# Altium project CSI_Inverter_400Hz_V1.2.PrjPcb
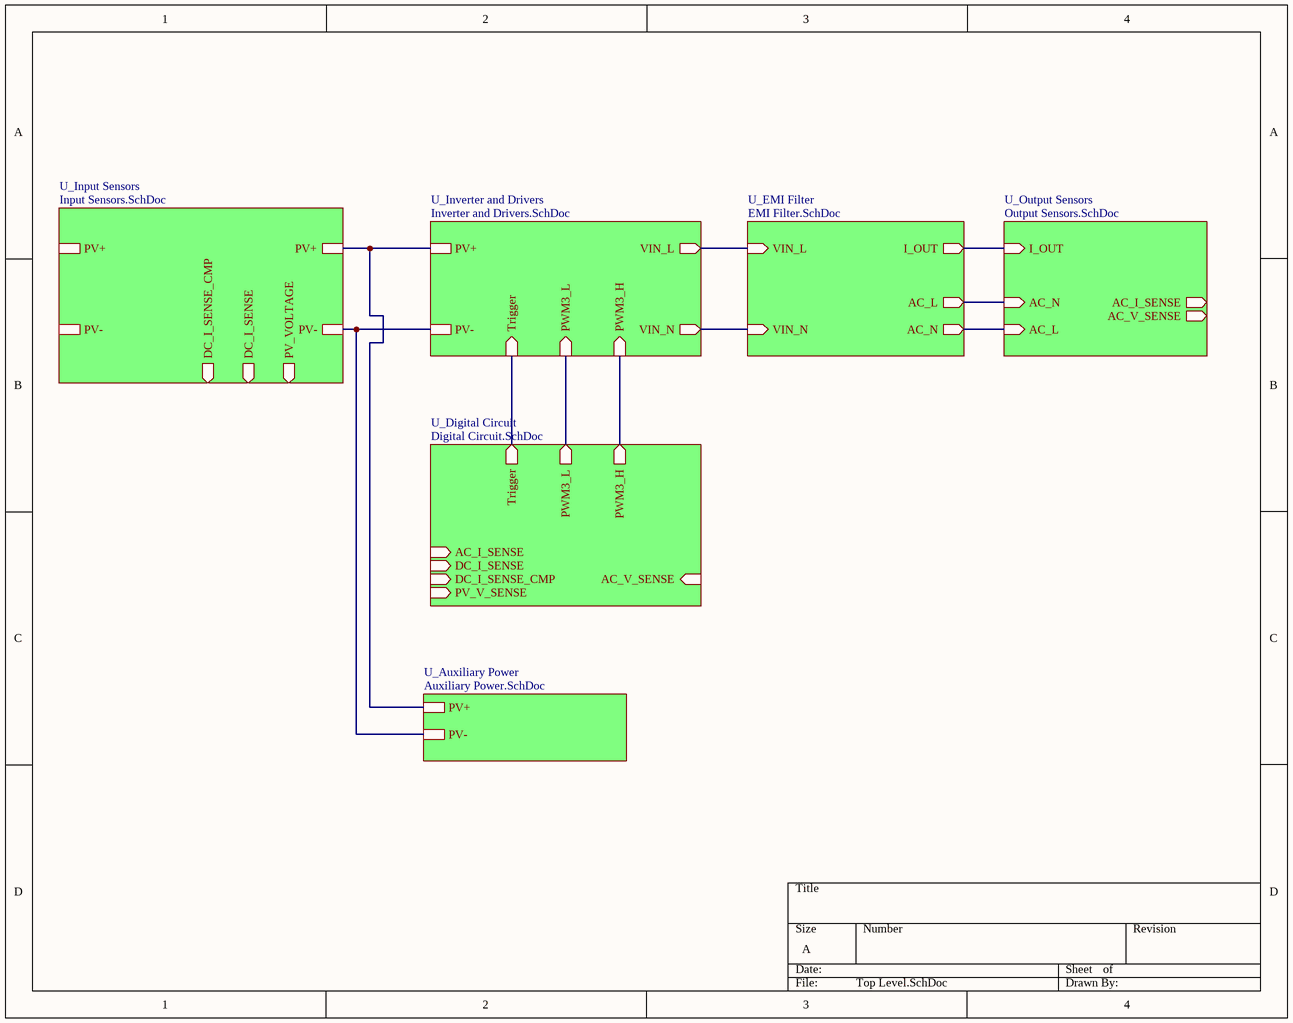
[diagram p0: Top Level.SchDoc]
7 sheets, 167 parts. Net scope: hierarchical (ports join the sheet entries above them; power ports are global).
Board file: PCB1.PcbDoc
Sheets:
  Top Level.SchDoc
    U_Inverter and Drivers = Inverter and Drivers.SchDoc
    U_Input Sensors = Input Sensors.SchDoc
    U_Output Sensors = Output Sensors.SchDoc
    U_EMI Filter = EMI Filter.SchDoc
    U_Digital Circuit = Digital Circuit.SchDoc
    U_Auxiliary Power = Auxiliary Power.SchDoc

## Sheet Top Level.SchDoc
size A

### Sub-sheets
U_Auxiliary Power = Auxiliary Power.SchDoc: PV-, PV+
U_Digital Circuit = Digital Circuit.SchDoc: PWM3_L (out), PWM3_H (out), Trigger (out), AC_I_SENSE (in), DC_I_SENSE (in), DC_I_SENSE_CMP (in), PV_V_SENSE (in), AC_V_SENSE (in)
U_EMI Filter = EMI Filter.SchDoc: VIN_L (in), VIN_N (in), I_OUT (out), AC_L (out), AC_N (out)
U_Input Sensors = Input Sensors.SchDoc: PV_VOLTAGE (out), PV-, DC_I_SENSE (out), DC_I_SENSE_CMP (out), PV+, PV+, PV-
U_Inverter and Drivers = Inverter and Drivers.SchDoc: VIN_L (out), VIN_N (out), Trigger (in), PWM3_L (in), PWM3_H (in), PV+, PV-
U_Output Sensors = Output Sensors.SchDoc: I_OUT (in), AC_N (in), AC_L (in), AC_I_SENSE (out), AC_V_SENSE (out)

### Nets
TH3_1: sheet U_Inverter and Drivers/PV-, sheet U_Input Sensors/PV-, sheet U_Input Sensors/PV-, sheet U_Auxiliary Power/PV-
AC_L: sheet U_Output Sensors/AC_L, sheet U_EMI Filter/AC_N
AC_N: sheet U_Output Sensors/AC_N, sheet U_EMI Filter/AC_L
I_OUT: sheet U_Output Sensors/I_OUT, sheet U_EMI Filter/I_OUT
PV+: sheet U_Inverter and Drivers/PV+, sheet U_Input Sensors/PV+, sheet U_Input Sensors/PV+, sheet U_Auxiliary Power/PV+
PWM3H: sheet U_Inverter and Drivers/PWM3_H, sheet U_Digital Circuit/PWM3_H
PWM3L: sheet U_Inverter and Drivers/PWM3_L, sheet U_Digital Circuit/PWM3_L
TH1_1: sheet U_Inverter and Drivers/VIN_L, sheet U_EMI Filter/VIN_L
TH2_1: sheet U_Inverter and Drivers/VIN_N, sheet U_EMI Filter/VIN_N
Trigger: sheet U_Inverter and Drivers/Trigger, sheet U_Digital Circuit/Trigger

## Sheet Inverter and Drivers.SchDoc
size A3
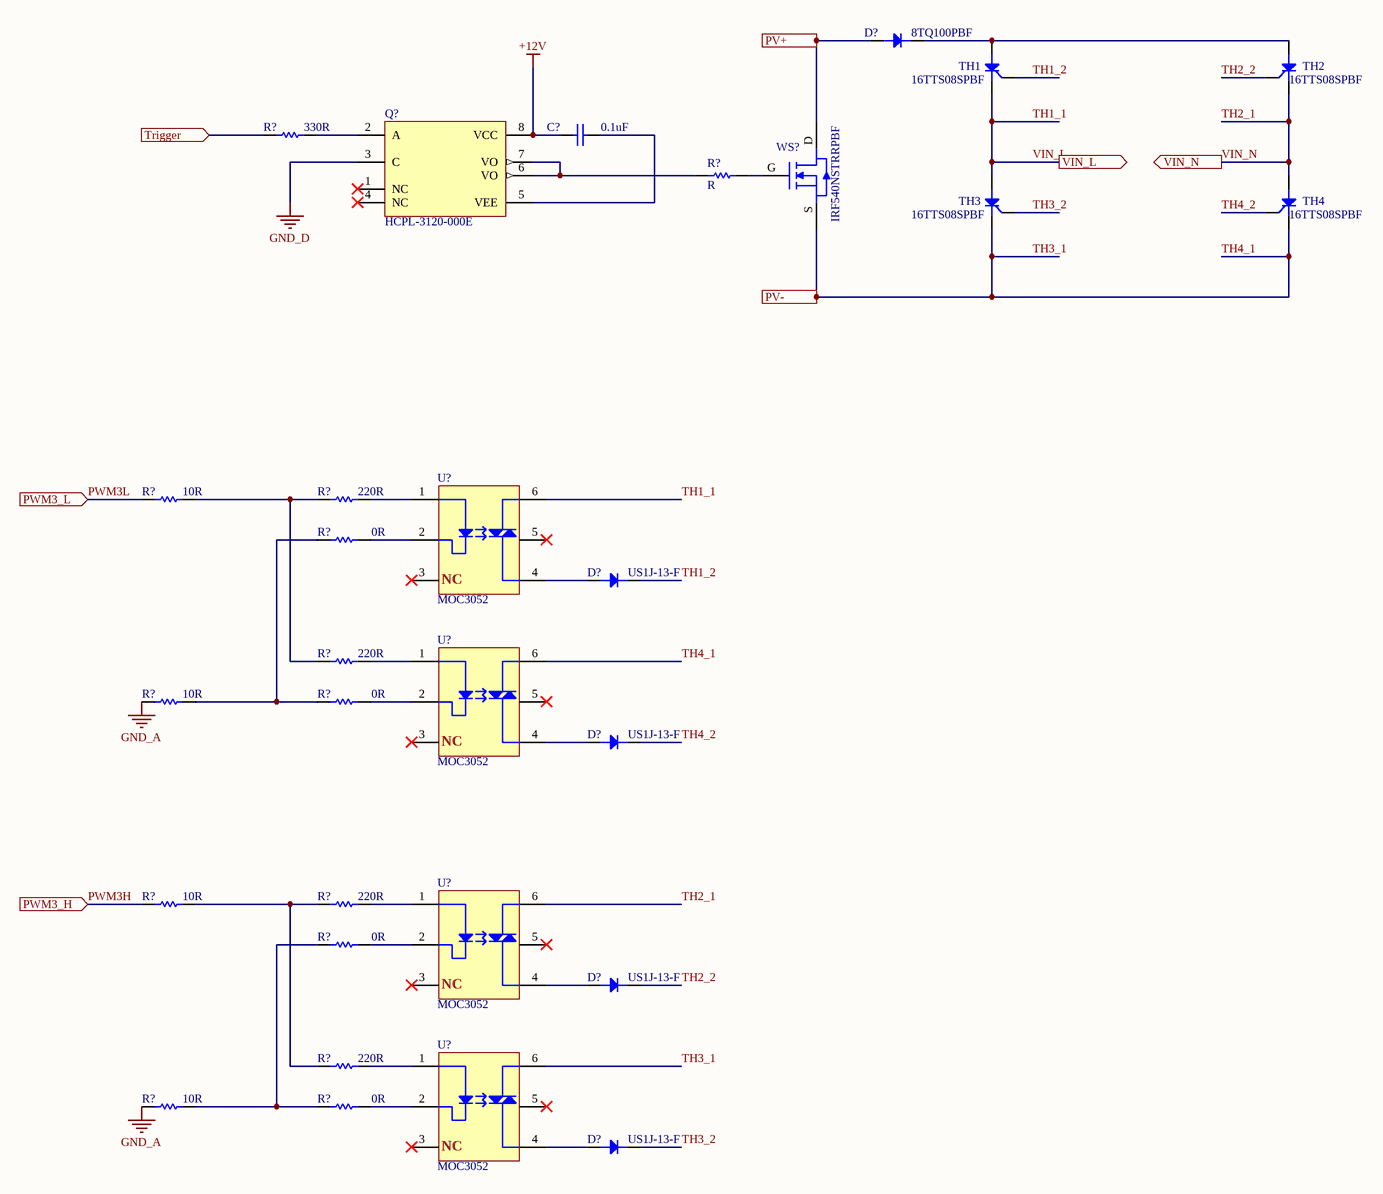
[diagram p1: Inverter and Drivers.SchDoc]

### Parts
(Parts that share a designator on the sheet are numbered #1, #2 ... from top to bottom, then left to right.)
C?#1  0.1uF  [1206 CAPACITOR]
D?#1  8TQ100PBF  [TO-220-2PIN]
D?#2  US1J-13-F  [SOT-523F]
D?#3  US1J-13-F  [SOT-523F]
D?#4  US1J-13-F  [SOT-523F]
D?#5  US1J-13-F  [SOT-523F]
Q?  HCPL-3120-000E  [FP-DIP-8-MFG]
R?#1  330R  [1206 Resistor Footprint]
R?#2  R  [1206 Resistor Footprint]
R?#3  10R  [1206 Resistor Footprint]
R?#4  220R  [1206 Resistor Footprint]
R?#5  0R  [1206 Resistor Footprint]
R?#6  220R  [1206 Resistor Footprint]
R?#7  10R  [1206 Resistor Footprint]
R?#8  0R  [1206 Resistor Footprint]
R?#9  10R  [1206 Resistor Footprint]
R?#10  220R  [1206 Resistor Footprint]
R?#11  0R  [1206 Resistor Footprint]
R?#12  220R  [1206 Resistor Footprint]
R?#13  10R  [1206 Resistor Footprint]
R?#14  0R  [1206 Resistor Footprint]
TH1  16TTS08SPBF
TH2  16TTS08SPBF
TH3  16TTS08SPBF
TH4  16TTS08SPBF
U?#1  MOC3052  [SDIP6]
U?#2  MOC3052  [SDIP6]
U?#3  MOC3052  [SDIP6]
U?#4  MOC3052  [SDIP6]
WS?  IRF540NSTRRPBF

### Ports
PV+, PV-, PWM3_H (in), PWM3_L (in), Trigger (in), VIN_L (out), VIN_N (out)

### Nets
+12V: C?#1.1 Q?.8(VCC)
GND_A: R?#7.1 R?#13.1
GND_D: Q?.3(C)
TH3_1: TH3.K TH4.K U?#2.6 U?#4.6 WS?.S ; port PV-  [also labelled TH4_1]
PV+: D?#1.A WS?.D ; port PV+
PWM3H: R?#9.1 ; port PWM3_H
PWM3L: R?#3.1 ; port PWM3_L
TH1_1: TH1.K TH3.A U?#1.6 ; port VIN_L  [also labelled VIN_L]
TH1_2: D?#2.K TH1.1
TH2_1: TH2.K TH4.A U?#3.6 ; port VIN_N  [also labelled VIN_N]
TH2_2: D?#4.K TH2.1
TH3_2: D?#5.K TH3.1
TH4_2: D?#3.K TH4.1
Trigger: R?#1.1 ; port Trigger
NetC?#1_2: C?#1.2 Q?.5(VEE)
NetD?#1_K: D?#1.K TH1.A TH2.A
NetD?#2_A: D?#2.A U?#1.4
NetD?#3_A: D?#3.A U?#2.4
NetD?#4_A: D?#4.A U?#3.4
NetD?#5_A: D?#5.A U?#4.4
NetQ?_2: Q?.2(A) R?#1.2
NetQ?_6: Q?.6(VO) Q?.7(VO) R?#2.1
NetR?#2_2: R?#2.2 WS?.G
NetR?#3_2: R?#3.2 R?#4.1 R?#6.1
NetR?#4_2: R?#4.2 U?#1.1
NetR?#5_1: R?#5.1 R?#7.2 R?#8.1
NetR?#5_2: R?#5.2 U?#1.2
NetR?#6_2: R?#6.2 U?#2.1
NetR?#8_2: R?#8.2 U?#2.2
NetR?#9_2: R?#9.2 R?#10.1 R?#12.1
NetR?#10_2: R?#10.2 U?#3.1
NetR?#11_1: R?#11.1 R?#13.2 R?#14.1
NetR?#11_2: R?#11.2 U?#3.2
NetR?#12_2: R?#12.2 U?#4.1
NetR?#14_2: R?#14.2 U?#4.2

Not connected (* = marked no-connect by the designer): Q? 1(NC)* 4(NC)*; U?#1 3* 5*; U?#2 3* 5*; U?#3 3* 5*; U?#4 3* 5*

### Notes on the sheet
- (in symbol MOC3052) NC

### Library data of the parts
C?#1 = Capacitor Non-Polorized: Value: 10uF; Case-EIA: 1206; Tolerance: -20% to +80%; Rated Voltage: 25 V; Case-Metric: 3216; Max Thickness: 1.9 mm; Technology: SMT
D?#1 = 8TQ100PBF: Diode Schottky 100V 8A Through Hole TO-220AC; MF: Vishay Semiconductor; SnapEDA_Link: https://www.snapeda.com/parts/8TQ100PBF/Vishay%20Semiconductor%20Diodes%20Division/view-part/454671/?ref=snap; Price: None; MP: 8TQ100PBF; Value: *; Availability: Unavailable; Package: TO-220 Vishay
D?#2-D?#5 = Diode
Q? = HCPL-3120-000E: OPTOISO 3.75KV 1CH GATE DVR 8DIP; Manufacturer: Broadcom; Power Dissipation: 295mW; Turn On Delay Time: 0.3us; Min Supply Voltage: 15V; Isolation Voltage: 3750Vrms; Reverse Voltage: 5V; Forward Voltage: 1.5V; Max Supply Voltage: 30V; Forward Current: 10mA; Standoff Height: 0.51mm; Temperature Range Low: -40°C; Device Class L2: Optocouplers; Automotive: No; Mouser Description: Optocoupler; THT; Channels: 1; Out: IGBT driver; 35kV/µs; 3.75kV; Height: 4.7mm; Digikey Description: OPTOISO 3.75KV 1CH GATE DVR 8DIP; Turn Off Delay Time: 0.3us; Device Class L3: unset; Package: DIP-8; RoHS: TRUE; ComponentLink2URL: https://docs.broadcom.com/docs/AV02-0161EN; Temperature: -40°C to +100°C; Temperature Range High: +100°C; Octopart: https://octopart.com/hcpl-3120-000e-broadcom-71128428; Manufacturer Part Number: HCPL-3120-000E; Category: Trans; Device Class L1: Optoelectronics; ComponentLink2Description: Datasheet; Lead Free: Yes; Ambient Temperature Range Low: -40°C; Ambient Temperature Range High: +100°C
R?#1-R?#14 = Resistor
TH1-TH4 = 16TTS08SPBF: Vishay, 16TTS08SPBF, Thyristor, 800V 10A, 60mA 3-pin, D2PAK; Hold Current: 100mA; RMS Current (Irms): 16A; Supplier 1: RSComponents; Manufacturer: Vishay; Manufacturer Part Number: 16TTS08SPBF; RoHS: Yes; Category: Thyristors; Mount: Surface Mount; Case/Package: D2PAK; Number of Pins: 3; Min Operating Temperature: -40°C; Max Operating Temperature: 125°C; Packaging: Rail/Tube; Max Repetitive Reverse Voltage (Vrrm): 800V; Current: 16A; Voltage: 800V; Length: 10.67mm; Height: 4.83mm; Width: 9.65mm; Lead Free: Lead Free; ComponentLink1URL: https://datasheet.ciiva.com/14801/vs-16tts08s-14801778.pdf?src-supplier=Arrow; ComponentLink1Description: https://datasheet.ciiva.com/14801/vs-16tts08s-14801778.pdf?src-supplier=Arrow; ComponentLink2URL: https://datasheet.ciiva.com/25624/0900766b800a9d57-25624882.pdf?src-supplier=RSComponents; ComponentLink2Description: https://datasheet.ciiva.com/25624/0900766b800a9d57-25624882.pdf?src-supplier=RSComponents; ComponentLink3URL: https://datasheet.ciiva.com/15247/vs-16tts08s-15247366.pdf?src-supplier=Arrow+Europe; ComponentLink3Description: https://datasheet.ciiva.com/15247/vs-16tts08s-15247366.pdf?src-supplier=Arrow+Europe; ComponentLink4URL: https://datasheet.ciiva.com/14166/07209018-14166634.pdf?src-supplier=Distrelec; ComponentLink4Description: https://datasheet.ciiva.com/14166/07209018-14166634.pdf?src-supplier=Distrelec; Supplier Part Number 1: 2640717P
U?#1-U?#4 = MOC3052: SCR Optoizolator
WS? = IRF540NSTRRPBF: Transistor MOSFET N Channel 100 Volt 33 Amp 3-Pin 2+ Tab D2pak Tape And Reel; Manufacturer: International Rectifier; Continuous Drain Current (ID): 33A; Gate to Source Voltage (Vgs): 20V; Rise Time: 35ns; Turn-Off Delay Time: 39ns; Turn-On Delay Time: 11ns; Power Dissipation: 130W; Number of Elements: 1; Drain to Source Voltage (Vdss): 100V; Max Power Dissipation: 3.8W; Rds On Max: 8.4mR; Input Capacitance: 2.29nF; Drain to Source Resistance: 44mR; Element Configuration: Single; Nominal Vgs: 4V; Supplier 1: Future Electronics; Manufacturer Part Number: IRF540NSTRRPBF; RoHS: Yes; Category: MOSFETs; Stock 1: 12403; Pricing 1: 1=1.14000, 50=1.00000, 100=0.98500, 250=0.95500, 500=0.93500 (USD); Mount: Surface Mount; Case/Package: D2PAK; Number of Pins: 3; Min Operating Temperature: -55°C; Max Operating Temperature: 175°C; Packaging: Tape and Reel; Fall Time: 35ns; Package Quantity: 800; Drain to Source Breakdown Voltage: 100V; Voltage Rating (DC): 100V; Current Rating: 33A; Length: 10.67mm; Height: 4.83mm; Width: 9.65mm; Radiation Hardening: No; Lead Free: Lead Free; REACH SVHC: No SVHC; ComponentLink1URL: https://datasheet.ciiva.com/6370/irf540nspbf-6370457.pdf?src-supplier=Digi-Key; ComponentLink1Description: https://datasheet.ciiva.com/6370/irf540nspbf-6370457.pdf?src-supplier=Digi-Key; ComponentLink2URL: https://datasheet.ciiva.com/6370/irf540nspbf-6370459.pdf?src-supplier=Digi-Key; ComponentLink2Description: https://datasheet.ciiva.com/6370/irf540nspbf-6370459.pdf?src-supplier=Digi-Key; ComponentLink3URL: https://datasheet.ciiva.com/6370/irf540nspbf-6370462.pdf?src-supplier=Digi-Key; ComponentLink3Description: https://datasheet.ciiva.com/6370/irf540nspbf-6370462.pdf?src-supplier=Digi-Key; Supplier Part Number 1: IRF540NSTRLPBF-CUTT

## Sheet Input Sensors.SchDoc
size A4
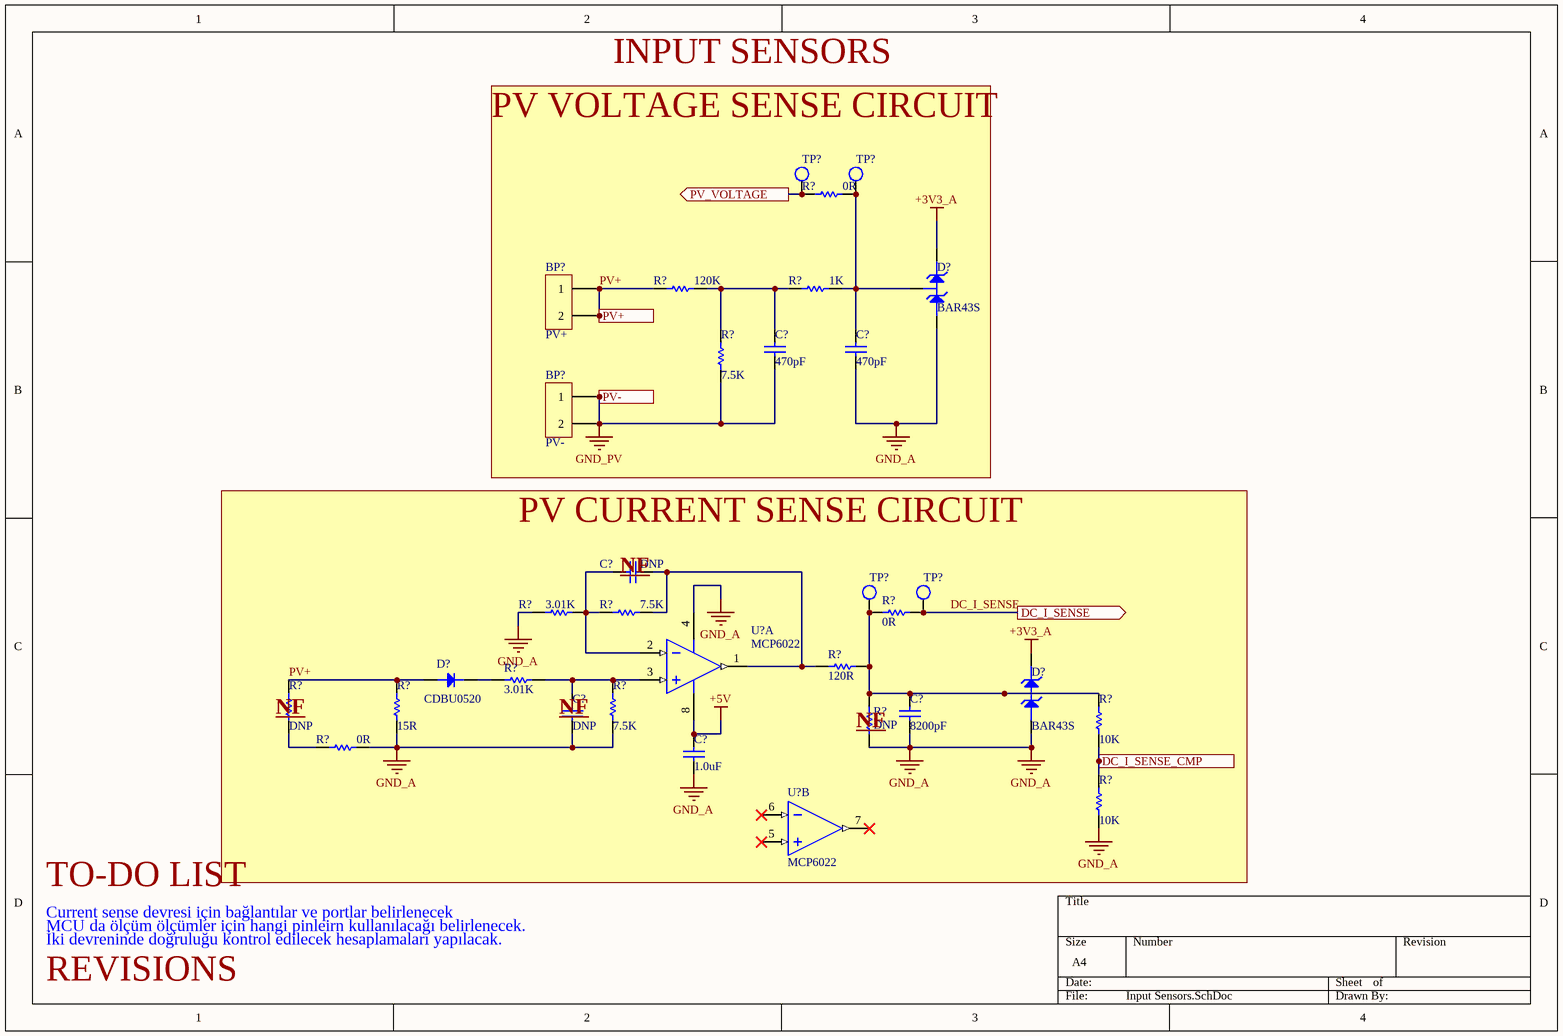
[diagram p2: Input Sensors.SchDoc]

### Parts
(Parts that share a designator on the sheet are numbered #1, #2 ... from top to bottom, then left to right.)
BP?#1  PV+
BP?#2  PV-
C?#2  470pF  [1206 CAPACITOR]
C?#3  470pF  [1206 CAPACITOR]
C?#4  DNP  [1206 CAPACITOR]
C?#5  DNP  [1206 CAPACITOR]
C?#6  8200pF  [1206 CAPACITOR]
C?#7  1.0uF  [1206 CAPACITOR]
D?#6  BAR43S  [SOT23-3]
D?#7  CDBU0520  [SOT-523F]
D?#8  BAR43S  [SOT23-3]
R?#15  0R  [1206 Resistor Footprint]
R?#16  120K  [1206 Resistor Footprint]
R?#17  1K  [1206 Resistor Footprint]
R?#18  7.5K  [1206 Resistor Footprint]
R?#19  3.01K  [1206 Resistor Footprint]
R?#20  7.5K  [1206 Resistor Footprint]
R?#21  0R  [1206 Resistor Footprint]
R?#22  120R  [1206 Resistor Footprint]
R?#23  3.01K  [1206 Resistor Footprint]
R?#24  DNP  [1206 Resistor Footprint]
R?#25  15R  [1206 Resistor Footprint]
R?#26  7.5K  [1206 Resistor Footprint]
R?#27  DNP  [1206 Resistor Footprint]
R?#28  10K  [1206 Resistor Footprint]
R?#29  0R  [1206 Resistor Footprint]
R?#30  10K  [1206 Resistor Footprint]
TP?#1  Test Point  [Test Point]  (value not drawn)
TP?#2  Test Point  [Test Point]  (value not drawn)
TP?#3  Test Point  [Test Point]  (value not drawn)
TP?#4  Test Point  [Test Point]  (value not drawn)
U?#5  MCP6022  [SOIC-SN8_M]  (part A of 2)
U?#6  MCP6022  [SOIC-SN8_M]  (part B of 2)

### Blocks framed on the sheet
PV CURRENT SENSE CIRCUIT: C?#4-C?#7 D?#7 D?#8 R?#19-R?#30 TP?#3 TP?#4 U?#5 U?#6

### Ports
DC_I_SENSE (out), DC_I_SENSE_CMP (out), PV+, PV-, PV_VOLTAGE (out)

### Nets
+3V3_A: D?#6.2 D?#8.2
+5V: C?#7.2 U?#5.8
GND_A: C?#3.1 C?#5.1 C?#6.1 C?#7.1 D?#6.1 D?#8.1 R?#19.1 R?#25.1 R?#26.1 R?#27.1 R?#29.2 R?#30.1 U?#5.4
GND_PV: BP?#2.1 BP?#2.2 C?#2.1 R?#18.1 ; port PV-  [project net TH3_1]
DC_I_SENSE: R?#21.1 TP?#4.1 ; port DC_I_SENSE
PV+: BP?#1.1 BP?#1.2 D?#7.A R?#16.1 R?#24.1 R?#25.2 ; port PV+
NetC?#2_2: C?#2.2 R?#16.2 R?#17.1 R?#18.2
NetC?#3_2: C?#3.2 D?#6.3 R?#15.2 R?#17.2 TP?#2.1
NetC?#4_1: C?#4.1 R?#20.2 R?#22.2 U?#5.1(VOUTA)
NetC?#4_2: C?#4.2 R?#19.2 R?#20.1 U?#5.2(VINA-)
NetC?#5_2: C?#5.2 R?#23.1 R?#26.2 U?#5.3(VINA+)
NetC?#6_2: C?#6.2 D?#8.3 R?#21.2 R?#22.1 R?#27.2 R?#28.2 TP?#3.1
NetD?#7_K: D?#7.K R?#23.2
NetR?#15_1: R?#15.1 TP?#1.1 ; port PV_VOLTAGE
NetR?#24_2: R?#24.2 R?#29.1
NetR?#28_1: R?#28.1 R?#30.2 ; port DC_I_SENSE_CMP

Not connected (* = marked no-connect by the designer): U?#6 5(VINB+)* 6(VINB-)* 7(VOUTB)*

### Notes on the sheet
- INPUT SENSORS
- PV VOLTAGE SENSE CIRCUIT
- (near C?#4) NF
- (near R?#24) NF
- (near C?#5) NF
- (near R?#27) NF
- TO-DO LIST
- Current sense devresi için bağlantılar ve portlar belirlenecek
- REVISIONS
- MCU da ölçüm ölçümler için hangi pinleirn kullanılacağı belirlenecek.
- İki devreninde doğruluğu kontrol edilecek hesaplamaları yapılacak.

### Library data of the parts
BP?#1 BP?#2 = TE Conn 63824-1: CONN QC TAB 0.250 SOLDER; Manufacturer: TE Connectivity; Body Material: Brass; Plating: Tin; Gender: Male; Insulation: Non-Insulated; Mating Tab Width: 0.25inch; Hole Diameter: 0.055inch; PCB Thickness: 0.062inch; Tab Width: 6.35mm; Tab Thickness: 0.83mm; Supplier 1: Arrow; Manufacturer Part Number: 63824-1; RoHS: Yes; Category: Headers and Wire Housings; Stock 1: 2670000; Pricing 1: 10000=0.03800, 20000=0.03520, 30000=0.03230, 50000=0.03040, 10000=0.03920, 20000=0.03630, 30000=0.03330, 50000=0.03140 (USD); Mount: Through Hole; Contact Plating: Tin; Color: Silver; Contact Material: Brass; Material: Brass; Body Plating: Tin; Terminal Material: Brass; Min Operating Temperature: -30°C; Max Operating Temperature: 110°C; Packaging: Tape and Reel; Package Quantity: 10000; Termination: Tab; Orientation: Straight; Length: 13.63mm; Height: 14.02mm; Depth: 7.92mm; Radiation Hardening: No; Lead Free: Lead Free; REACH SVHC: Unknown; ELV: Compliant; ComponentLink1URL: https://datasheet.ciiva.com/19463/853927-19463156.pdf?src-supplier=Jameco; ComponentLink1Description: https://datasheet.ciiva.com/19463/853927-19463156.pdf?src-supplier=Jameco; ComponentLink2URL: https://datasheet.ciiva.com/11721/0900766b80ddd72b-11721738.pdf?src-supplier=RSComponents; ComponentLink2Description: https://datasheet.ciiva.com/11721/0900766b80ddd72b-11721738.pdf?src-supplier=RSComponents; ComponentLink3URL: https://datasheet.ciiva.com/16672/eng-cs-82004-faston-pcb-tabs-receptacles-0914-16672135.pdf?src-supplier=Avnet+Europe; ComponentLink3Description: https://datasheet.ciiva.com/16672/eng-cs-82004-faston-pcb-tabs-receptacles-0914-16672135.pdf?src-supplier=Avnet+Europe; ComponentLink4URL: https://datasheet.ciiva.com/46393/1650963-46393511.pdf?src-supplier=Element14; ComponentLink4Description: https://datasheet.ciiva.com/46393/1650963-46393511.pdf?src-supplier=Element14; ComponentLink5URL: https://datasheet.ciiva.com/839/eng-cd-63824-r-basefilename-839115.pdf?src-supplier=Digi-Key; ComponentLink5Description: https://datasheet.ciiva.com/839/eng-cd-63824-r-basefilename-839115.pdf?src-supplier=Digi-Key; ComponentLink6URL: https://datasheet.ciiva.com/7873/1650963-7873563.pdf?src-supplier=Element14; ComponentLink6Description: https://datasheet.ciiva.com/7873/1650963-7873563.pdf?src-supplier=Element14; ComponentLink7URL: https://datasheet.ciiva.com/3144/eng-cs-82004-faston-pcb-tabs-receptacles-0914-3144076.pdf?src-supplier=Avnet; ComponentLink7Description: https://datasheet.ciiva.com/3144/eng-cs-82004-faston-pcb-tabs-receptacles-0914-3144076.pdf?src-supplier=Avnet; ComponentLink8URL: https://datasheet.ciiva.com/15168/getdatasheetpartid-110188-15168813.pdf?src-supplier=Verical; ComponentLink8Description: https://datasheet.ciiva.com/15168/getdatasheetpartid-110188-15168813.pdf?src-supplier=Verical; ComponentLink9URL: https://datasheet.ciiva.com/16494/eng-cs-82004-faston-pcb-tabs-receptacles-0914-16494590.pdf?src-supplier=Avnet+Asia; ComponentLink9Description: https://datasheet.ciiva.com/16494/eng-cs-82004-faston-pcb-tabs-receptacles-0914-16494590.pdf?src-supplier=Avnet+Asia; Supplier Part Number 1: 63824-1
C?#2-C?#7 = Capacitor Non-Polorized: as C?#1 on sheet Inverter and Drivers; Max Thickness: 1.9 mm; Technology: SMT
D?#6 D?#8 = Schottky Rectifier
D?#7 = Diode
R?#15-R?#30 = Resistor
U?#5 U?#6 = Op-Amp: PackageDescription: 8-Lead Plastic Small Outline (SN) - Narrow, 3.90mm Body [SOIC]; ComponentLink2Description: Datasheet; ComponentLink3Description: Package Specification; Code_JEDEC: MS-012; RevisionNote: URLs added.; DatasheetVersion: revD, Feb-2009; Code_IPC: SOIC127P600-8; ComponentLink3URL: http://www.microchip.com/stellent/groups/techpub_sg/documents/packagingspec/en012702.pdf; PackageReference: SOIC-SN8; PackageVersion: revBB, Aug-2009; ComponentLink2URL: http://ww1.microchip.com/downloads/en/DeviceDoc/21685d.pdf; ComponentLink1URL: http://www.microchip.com/; ComponentLink1Description: Manufacturer URL

## Sheet Output Sensors.SchDoc
size A
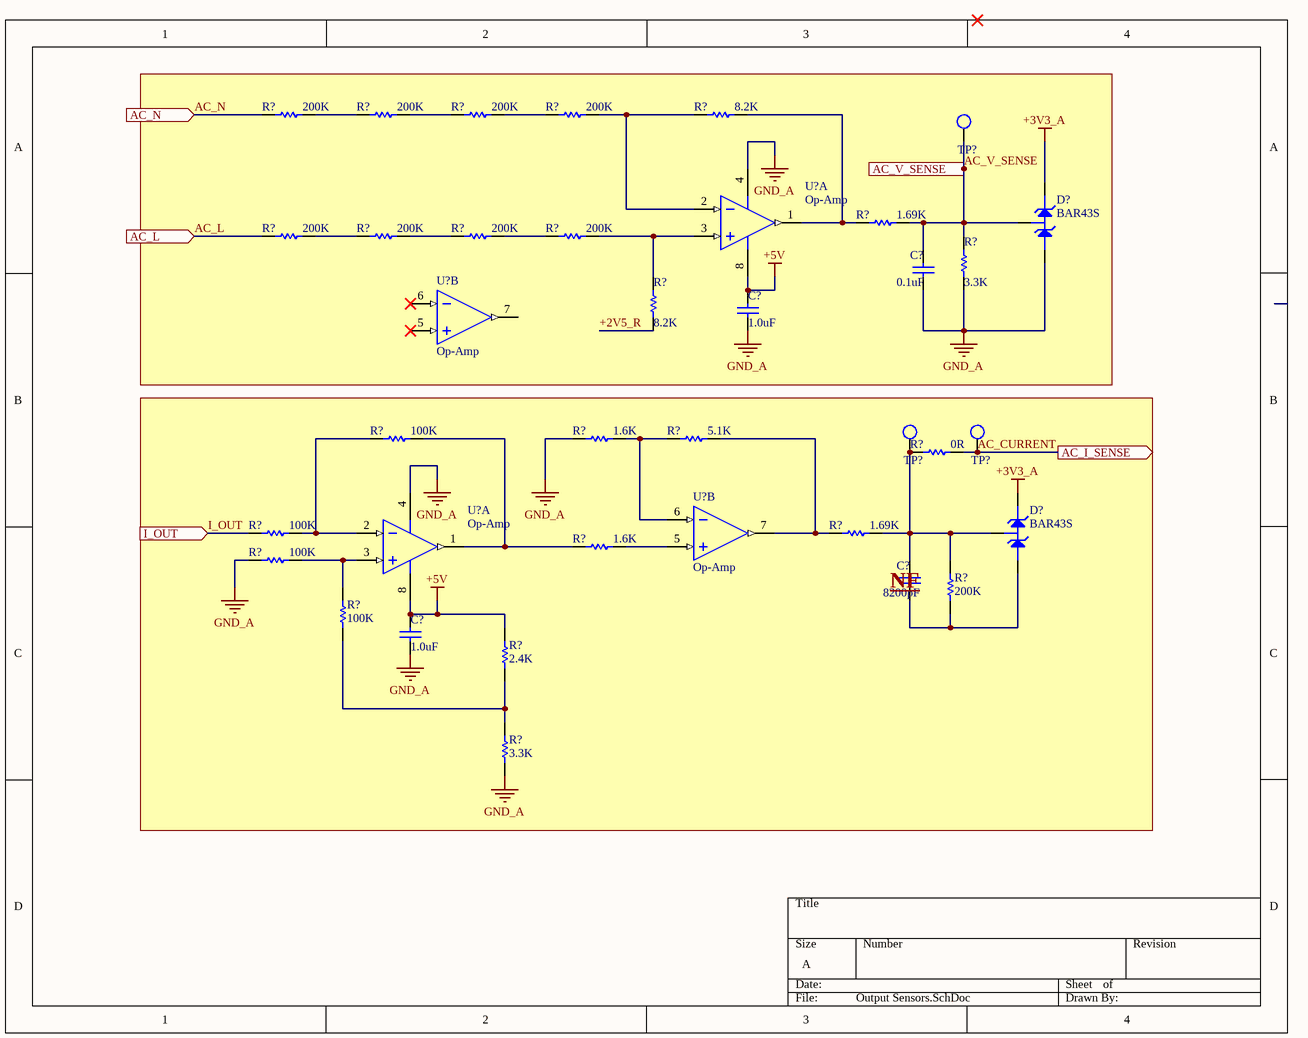
[diagram p3: Output Sensors.SchDoc]

### Parts
(Parts that share a designator on the sheet are numbered #1, #2 ... from top to bottom, then left to right.)
C?#8  0.1uF  [1206 CAPACITOR]
C?#9  1.0uF  [1206 CAPACITOR]
C?#10  8200pF  [1206 CAPACITOR]
C?#11  1.0uF  [1206 CAPACITOR]
D?#9  BAR43S  [SOT23-3]
D?#10  BAR43S  [SOT23-3]
R?#31  200K  [1206 Resistor Footprint]
R?#32  200K  [1206 Resistor Footprint]
R?#33  200K  [1206 Resistor Footprint]
R?#34  200K  [1206 Resistor Footprint]
R?#35  8.2K  [1206 Resistor Footprint]
R?#36  1.69K  [1206 Resistor Footprint]
R?#37  200K  [1206 Resistor Footprint]
R?#38  200K  [1206 Resistor Footprint]
R?#39  200K  [1206 Resistor Footprint]
R?#40  200K  [1206 Resistor Footprint]
R?#41  3.3K  [1206 Resistor Footprint]
R?#42  8.2K  [1206 Resistor Footprint]
R?#43  100K  [1206 Resistor Footprint]
R?#44  1.6K  [1206 Resistor Footprint]
R?#45  5.1K  [1206 Resistor Footprint]
R?#46  0R  [1206 Resistor Footprint]
R?#47  100K  [1206 Resistor Footprint]
R?#48  1.69K  [1206 Resistor Footprint]
R?#49  1.6K  [1206 Resistor Footprint]
R?#50  100K  [1206 Resistor Footprint]
R?#51  200K  [1206 Resistor Footprint]
R?#52  100K  [1206 Resistor Footprint]
R?#53  2.4K  [1206 Resistor Footprint]
R?#54  3.3K  [1206 Resistor Footprint]
TP?#5  Test Point  [Test Point]  (value not drawn)
TP?#6  Test Point  [Test Point]  (value not drawn)
TP?#7  Test Point  [Test Point]  (value not drawn)
U?#7  Op-Amp  [SOIC-SN8_M]  (part A of 2)
U?#8  Op-Amp  [SOIC-SN8_M]  (part B of 2)
U?#9  Op-Amp  [SOIC-SN8_M]  (part B of 2)
U?#10  Op-Amp  [SOIC-SN8_M]  (part A of 2)

### Blocks framed on the sheet
NF: C?#10 C?#11 D?#10 R?#43-R?#54 TP?#6 TP?#7 U?#9 U?#10

### Ports
AC_I_SENSE (out), AC_L (in), AC_N (in), AC_V_SENSE (out), I_OUT (in)

### Nets
+3V3_A: D?#9.2 D?#10.2
+5V: C?#9.2 C?#11.2 R?#53.2 U?#7.8 U?#10.8
GND_A: C?#8.1 C?#9.1 C?#11.1 D?#9.1 R?#41.1 R?#44.1 R?#50.1 R?#54.1 U?#7.4 U?#10.4
+2V5_R: R?#42.1
AC_CURRENT: R?#46.2 TP?#7.1 ; port AC_I_SENSE
AC_L: R?#37.1 ; port AC_L
AC_N: R?#31.1 ; port AC_N
AC_V_SENSE: C?#8.2 D?#9.3 R?#36.2 R?#41.2 TP?#5.1 ; port AC_V_SENSE
I_OUT: R?#47.1 ; port I_OUT
NetC?#10_1: C?#10.1 D?#10.1 R?#51.1
NetC?#10_2: C?#10.2 D?#10.3 R?#46.1 R?#48.2 R?#51.2 TP?#6.1
NetR?#31_2: R?#31.2 R?#32.1
NetR?#32_2: R?#32.2 R?#33.1
NetR?#33_2: R?#33.2 R?#34.1
NetR?#34_2: R?#34.2 R?#35.1 U?#7.2(VINA-)
NetR?#35_2: R?#35.2 R?#36.1 U?#7.1(VOUTA)
NetR?#37_2: R?#37.2 R?#38.1
NetR?#38_2: R?#38.2 R?#39.1
NetR?#39_2: R?#39.2 R?#40.1
NetR?#40_2: R?#40.2 R?#42.2 U?#7.3(VINA+)
NetR?#43_1: R?#43.1 R?#47.2 U?#10.2(VINA-)
NetR?#43_2: R?#43.2 R?#49.1 U?#10.1(VOUTA)
NetR?#44_2: R?#44.2 R?#45.1 U?#9.6(VINB-)
NetR?#45_2: R?#45.2 R?#48.1 U?#9.7(VOUTB)
NetR?#49_2: R?#49.2 U?#9.5(VINB+)
NetR?#50_2: R?#50.2 R?#52.2 U?#10.3(VINA+)
NetR?#52_1: R?#52.1 R?#53.1 R?#54.2

Not connected (* = marked no-connect by the designer): U?#8 5(VINB+)* 6(VINB-)* 7(VOUTB)

### Library data of the parts
C?#8-C?#11 = Capacitor Non-Polorized: as C?#1 on sheet Inverter and Drivers; Max Thickness: 1.9 mm; Technology: SMT
D?#9 D?#10 = Schottky Rectifier
R?#31-R?#54 = Resistor
U?#7-U?#10 = Op-Amp: PackageDescription: 8-Lead Plastic Small Outline (SN) - Narrow, 3.90mm Body [SOIC]; ComponentLink2Description: Datasheet; ComponentLink3Description: Package Specification; Code_JEDEC: MS-012; RevisionNote: URLs added.; DatasheetVersion: revD, Feb-2009; Code_IPC: SOIC127P600-8; ComponentLink3URL: http://www.microchip.com/stellent/groups/techpub_sg/documents/packagingspec/en012702.pdf; PackageReference: SOIC-SN8; PackageVersion: revBB, Aug-2009; ComponentLink2URL: http://ww1.microchip.com/downloads/en/DeviceDoc/21685d.pdf; ComponentLink1URL: http://www.microchip.com/; ComponentLink1Description: Manufacturer URL

## Sheet EMI Filter.SchDoc
size A
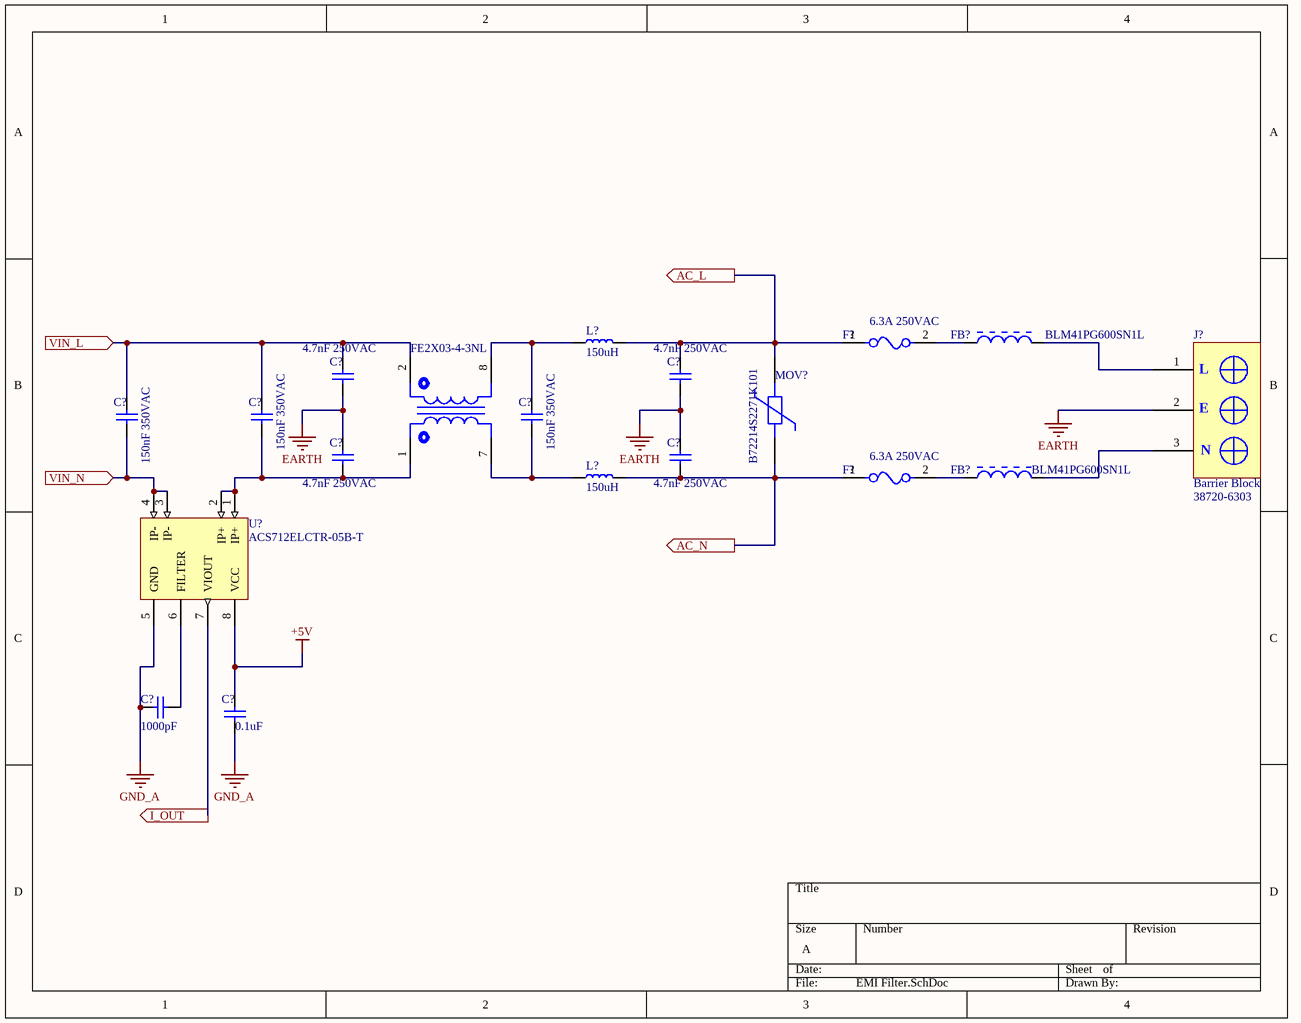
[diagram p4: EMI Filter.SchDoc]

### Parts
(Parts that share a designator on the sheet are numbered #1, #2 ... from top to bottom, then left to right.)
?  FE2X03-4-3NL  [FE2X03-4-3NL]
C?#12  4.7nF 250VAC  [1206 CAPACITOR]
C?#13  4.7nF 250VAC  [1206 CAPACITOR]
C?#14  150nF 350VAC  [1206 CAPACITOR]
C?#15  150nF 350VAC  [1206 CAPACITOR]
C?#16  150nF 350VAC  [1206 CAPACITOR]
C?#17  4.7nF 250VAC  [1206 CAPACITOR]
C?#18  4.7nF 250VAC  [1206 CAPACITOR]
C?#19  1000pF  [1206 CAPACITOR]
C?#20  0.1uF  [1206 CAPACITOR]
F?#1  6.3A 250VAC  [230VAC RADIAL FUSE]
F?#2  6.3A 250VAC  [230VAC RADIAL FUSE]
FB?#1  BLM41PG600SN1L  [Ferrite Bead]
FB?#2  BLM41PG600SN1L  [Ferrite Bead]
J?#1  Barrier Block  Supplier Part Number 1: 38720-6303  [Blcok Terminal]
L?#1  150uH  [Inductor MSS7341-224ML]
L?#2  150uH  [Inductor MSS7341-224ML]
MOV?  B72214S2271K101  [DISC 14MM]
U?#11  ACS712ELCTR-05B-T  [8 Lead SOIC]

### Ports
AC_L (out), AC_N (out), I_OUT (out), VIN_L (in), VIN_N (in)

### Nets
+5V: C?#20.2 U?#11.8(VCC)
EARTH: C?#12.1 C?#13.1 C?#17.2 C?#18.2 J?#1.2
GND_A: C?#19.1 C?#20.1 U?#11.5(GND)
AC_L: C?#18.1 F?#2.1 L?#2.2 MOV?.2 ; port AC_N
AC_N: C?#13.2 F?#1.1 L?#1.2 MOV?.1 ; port AC_L
I_OUT: U?#11.7(VIOUT) ; port I_OUT
TH1_1: ?.2 C?#12.2 C?#14.2 C?#15.2 ; port VIN_L
TH2_1: C?#14.1 U?#11.3(IP-) U?#11.4(IP-) ; port VIN_N
Net?_1: ?.1 C?#15.1 C?#17.1 U?#11.1(IP+) U?#11.2(IP+)
Net?_7: ?.7 C?#16.1 L?#2.1
Net?_8: ?.8 C?#16.2 L?#1.1
NetC?#19_2: C?#19.2 U?#11.6(FILTER)
NetF?#1_2: F?#1.2 FB?#1.1
NetF?#2_2: F?#2.2 FB?#2.1
NetFB?#1_2: FB?#1.2 J?#1.1
NetFB?#2_2: FB?#2.2 J?#1.3

### Notes on the sheet
- (in symbol Barrier Block) L; E; N

### Library data of the parts
? = FE2X03-4-3NL: CHOKE COM MODE 2PHASE NOISE SUP; Manufacturer: Pulse; Number of Lines: 2; Lead/Base Style: PC Pin; Inductance: 3.3mH; DC Resistance (DCR): 90mR; Current: 2.5A; Self Resonant Frequency: 700kHz; Supplier 1: Mouser; Manufacturer Part Number: FE2X03-4-3NL; RoHS: Yes; Category: Common Mode Chokes; Stock 1: 485; Pricing 1: 1=3.62000, 10=3.22000, 100=2.17000, 250=2.10000, 500=1.93000, 1000=1.81000 (USD); Mount: Through Hole; Case/Package: DIP; Number of Pins: 4; Min Operating Temperature: 0°C; Max Operating Temperature: 60°C; Packaging: Rail/Tube; Package Quantity: 20; Max DC Current: 2.5A; Termination: Radial; Length: 22.9mm; Height: 0.606inch; Width: 22.9mm; Lead Pitch: 4mm; Depth: 22.9mm; Radiation Hardening: No; ComponentLink1URL: https://datasheet.ciiva.com/3293/+p538-3293276.pdf?src-supplier=Avnet; ComponentLink1Description: https://datasheet.ciiva.com/3293/+p538-3293276.pdf?src-supplier=Avnet; ComponentLink2URL: https://datasheet.ciiva.com/6214/+p538-6214495.pdf?src-supplier=Digi-Key; ComponentLink2Description: https://datasheet.ciiva.com/6214/+p538-6214495.pdf?src-supplier=Digi-Key; Supplier Part Number 1: 673-FE2X03-4-3NL
C?#12-C?#20 = Capacitor Non-Polorized: as C?#1 on sheet Inverter and Drivers; Max Thickness: 1.9 mm; Technology: SMT
F?#1 F?#2 = FUSE 6.3A: FUSE BOARD MNT 500MA 250VAC RAD; Manufacturer: Schurter; Manufacturer Part Number: 0034.6011; Max Fuse Ac Voltage: 250V; Fuse I2T: 0.09A2Sec; Fuse Current: 0.5A; Standoff Height: 0.5mm; Fuse Voltage Drop: 350mV; Fuse Blow Speed: Fast; Category: Fuse; RoHS: TRUE; Device Class L3: unset; Lead Free: Yes; Height: 8.5mm; ComponentLink2URL: https://us.schurter.com/en/datasheet/typ_MSF_250.pdf; Voltage Rating: 250V; ComponentLink2Description: Datasheet; Ambient Temperature Range Low: -40°C; Digikey Description: FUSE BOARD MNT 500MA 250VAC RAD; Automotive: No; Octopart: https://octopart.com/0034.6011-schurter-8310; Package: 0034.6011; Device Class L2: Fuses; Ambient Temperature Range High: +85°C; Device Class L1: Circuit Protection
FB?#1 FB?#2 = Ferrite Bead: Chip Ferrite Bead for Power Lines, 60 Ohm, 6000 mA, -55 to 125 degC, 4.5 x 1.6 x 1.8 mm SMD, Tape and Reel; Manufacturer: Murata; Rated Current: 6000 mA; Impedance (at 100 MHz): 60 Ohm Typ.; DC Resistance: 0.009 Ohm Max.; Packing: Tape and Reel; Mounting Technology: Surface Mount; ComponentLink3URL: http://www.murata.com/products/catalog/pdf/c31e.pdf; ComponentLink3Description: Package Specification; ComponentLink1URL: http://www.murata.com/; PackageDescription: 2-Pin Chip, Body 4.5 x 1.6 mm; ComponentLink1Description: Manufacturer URL; ComponentLink2URL: http://www.murata.com/products/catalog/pdf/c31e.pdf; PartNumber: BLM41PG600SN1L; ComponentLink2Description: Datasheet; PackageReference: BLM41-2; Operating Temperature Range: -55 to 125 degC; DatasheetVersion: 08/2013
J?#1 = Barrier Block: Conn Barrier Strip 3 POS 9.52mm Solder ST Thru-Hole 15A/Contact; Manufacturer: Molex; Manufacturer Part Number: 0387206303; Number of Circuits: 3; Current Rating: 15A; Voltage Rating: 300V; Pitch: 0.375inch; Wire Gauge (Max): 22AWG; Wire Gauge (Min): 14AWG; Supplier 1: Arrow; RoHS: Yes; Category: Terminal Blocks; Stock 1: 404; Pricing 1: 1=2.52170, 10=1.97000, 25=1.82640, 50=1.64670, 100=1.59580, 250=1.40110, 500=1.27850, 1000=1.15620, 5000=1.01550 (USD); Mount: Through Hole; Contact Plating: Zinc; Contact Material: Steel; Color: Black; Housing Material: Thermoplastic; Housing Color: Black; Insulation Material: Thermoplastic; Min Operating Temperature: -40°C; Max Operating Temperature: 130°C; Termination: Solder; Number of Contacts: 3; Number of Rows: 1; Packaging: Tray; Orientation: Straight; Number of Wire Entries: 3; Max Supply Voltage: 300V; Length: 30.7mm; Depth: 15.7mm; Radiation Hardening: No; Flammability Rating: UL94 V-0; ComponentLink1URL: https://datasheet.ciiva.com/15170/getdatasheetpartid-255060-15170068.pdf?src-supplier=Verical; ComponentLink1Description: https://datasheet.ciiva.com/15170/getdatasheetpartid-255060-15170068.pdf?src-supplier=Verical; ComponentLink2URL: https://datasheet.ciiva.com/3141/0387206303-terminal-blocks-3141193.pdf?src-supplier=Avnet; ComponentLink2Description: https://datasheet.ciiva.com/3141/0387206303-terminal-blocks-3141193.pdf?src-supplier=Avnet; ComponentLink3URL: https://datasheet.ciiva.com/18547/387206306-sd-18547693.pdf?src-supplier=Digi-Key; ComponentLink3Description: https://datasheet.ciiva.com/18547/387206306-sd-18547693.pdf?src-supplier=Digi-Key
L?#1 L?#2 = Inductor
MOV? = B72214S2271K101: SUPPRESSOR; Product Range:AdvanceD Series; Voltage Rating VDC:350V; Peak Surge Current @ 8/20 S:6kA; Varistor Case Style:Disc 14mm; Clamping Voltage Vc Max:710V; Peak Energy (10/1000uS):110J; Voltage Rating VAC:275V; MSL:- ;RoHS Compliant: Yes; Manufacturer: TDK EPCOS; Number of Circuits: 1; Max Voltage Rating (AC): 275V; Max Voltage Rating (DC): 350V; Energy: 110J; Max Surge Current: 6kA; Min Varistor Voltage: 387V; Varistor Voltage: 430V; Max Varistor Voltage: 473V; Supplier 1: Mouser; Manufacturer Part Number: B72214S2271K101; RoHS: Yes; Category: Varistors; Stock 1: 3472; Pricing 1: 1=0.58000, 10=0.43600, 100=0.28900, 1000=0.21800, 2500=0.19000, 10000=0.17300, 25000=0.16800, 50000=0.16400, 100000=0.16000 (USD); Mount: Through Hole; Case/Package: Radial; Package Quantity: 500; Packaging: Bulk; ComponentLink1URL: https://datasheet.ciiva.com/3024/siov-leaded-advanced-3024826.pdf?src-supplier=Avnet; ComponentLink1Description: https://datasheet.ciiva.com/3024/siov-leaded-advanced-3024826.pdf?src-supplier=Avnet; Supplier Part Number 1: 871-B72214S2271K101
U?#11 = ACS712ELCTR-05B-T: Linear Current Sensor, 4.5 to 5.5 V, 10 mA Output Current, -40 to 85 degC, 8-Pin SOIC (LC), RoHS, Tape and Reel; Manufacturer: Allegro Microsystems; SVHC: NoSVHC(19-Dec-2012); Supply Voltage Min: 4.5V; Accuracy: 1.5%; No. of Pins: 8; Supply Voltage Max: 5.5V; Bandwidth: 50kHz; Quiescent Current: 8mA; Supply Voltage Range: 4.5Vto5.5V; Polarisation: Unipolar; Package Description: 8-Pin Small Outline Integrated Circuit, Body 4.9 x 3.9 mm, Pitch 1.27 mm; Operating Temperature Min: -40degC; Datasheet URL: http://www.allegromicro.com/~/media/Files/Datasheets/ACS712-Datasheet.ashx?la=en; Operating Temperature Range: -40degCto+85degC; MSL: MSL2-1year; Sensor Case Style: SOIC; Termination Type: SMD; Manufacturer URL: http://www.allegromicro.com/; Sensor / Transducer Type: Current; Package Reference: LC-8; Operating Temperature Max: 85degC; Datasheet Version: Rev. 15, 11/2012

## Sheet Digital Circuit.SchDoc
size A3
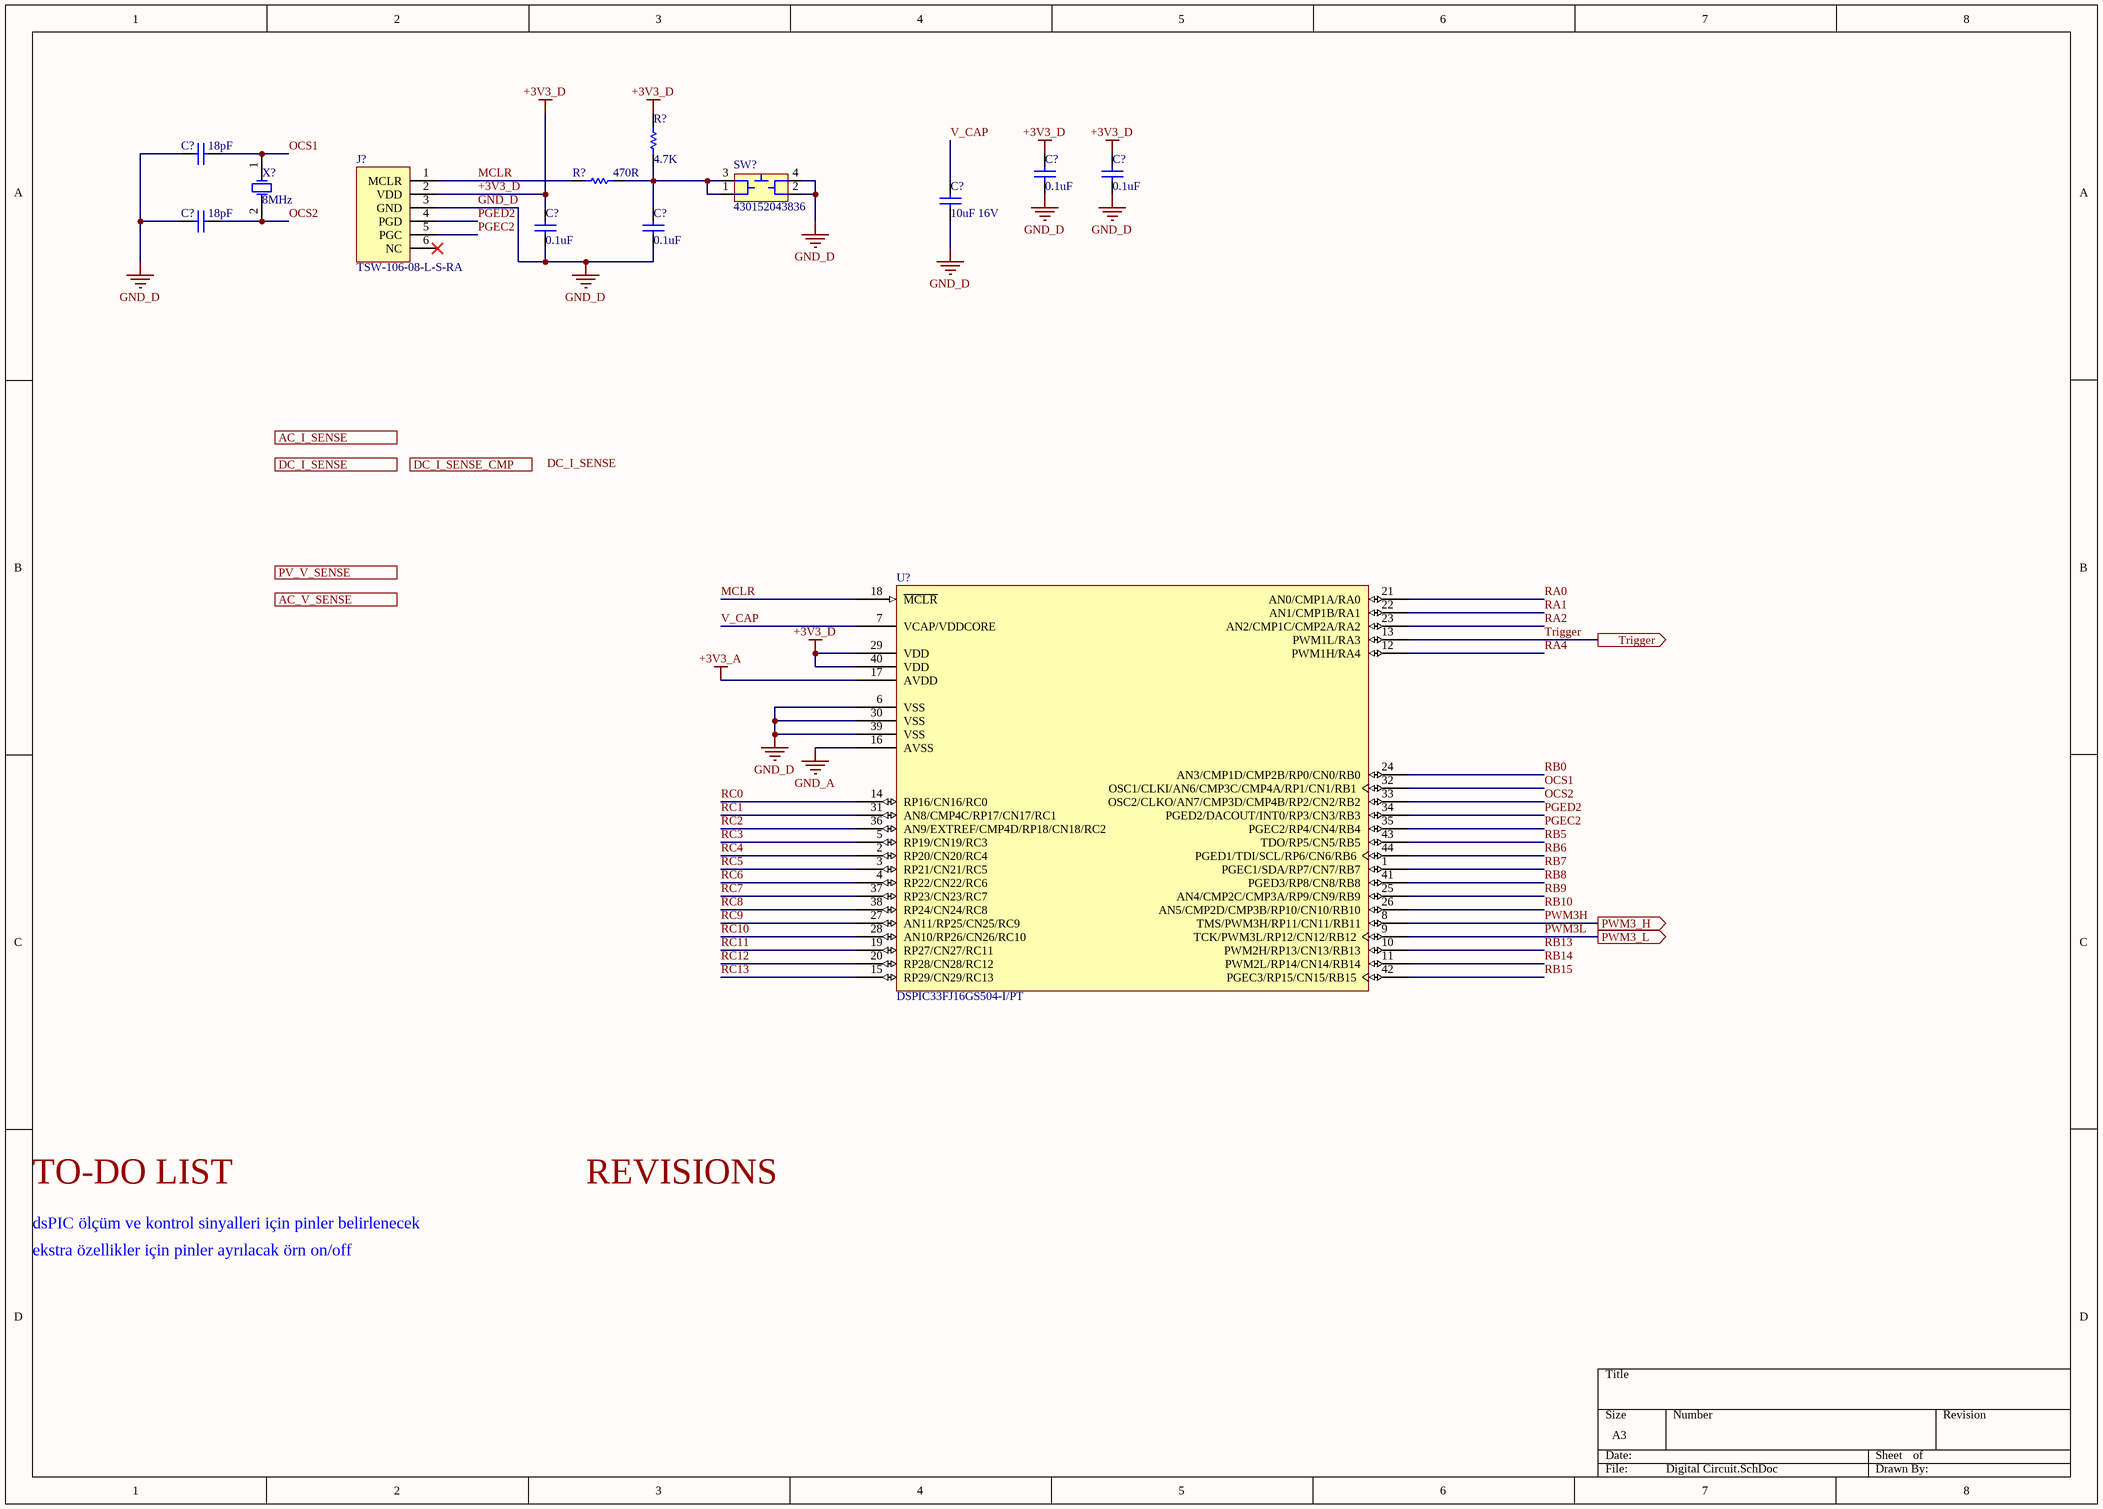
[diagram p5: Digital Circuit.SchDoc]

### Parts
(Parts that share a designator on the sheet are numbered #1, #2 ... from top to bottom, then left to right.)
C?#21  18pF  [1206 CAPACITOR]
C?#22  0.1uF  [1206 CAPACITOR]
C?#23  0.1uF  [1206 CAPACITOR]
C?#24  10uF 16V  [1206 CAPACITOR]
C?#25  18pF  [1206 CAPACITOR]
C?#26  0.1uF  [1206 CAPACITOR]
C?#27  0.1uF  [1206 CAPACITOR]
J?#2  TSW-106-08-L-S-RA  [1x6 Header 2.54mm]
R?#55  4.7K  [1206 Resistor Footprint]
R?#56  470R  [1206 Resistor Footprint]
SW?  430152043836  [6x6mm Button]
U?#12  DSPIC33FJ16GS504-I/PT  [dsPIC33F16GS504 Connector]
X?  8MHz  [HC-49/US Crystal Footprint]

### Ports
AC_I_SENSE (in), AC_V_SENSE (in), DC_I_SENSE (in), DC_I_SENSE_CMP (in), PV_V_SENSE (in), PWM3_H (out), PWM3_L (out), Trigger (out)

### Nets
+3V3_A: U?#12.17(AVDD)
+3V3_D: C?#22.2 C?#23.2 C?#26.2 J?#2.2(VDD) R?#55.2 U?#12.29(VDD) U?#12.40(VDD)
GND_A: U?#12.16(AVSS)
GND_D: C?#21.1 C?#22.1 C?#23.1 C?#24.1 C?#25.1 C?#26.1 C?#27.1 J?#2.3(GND) SW?.2 SW?.4 U?#12.6(VSS) U?#12.30(VSS) U?#12.39(VSS)
MCLR: J?#2.1(MCLR) R?#56.1 U?#12.18(~{MCLR})
OCS1: C?#21.2 U?#12.32(OSC1/CLKI/AN6/CMP3C/CMP4A/RP1/CN1/RB1) X?.1(X1)
OCS2: C?#25.2 U?#12.33(OSC2/CLKO/AN7/CMP3D/CMP4B/RP2/CN2/RB2) X?.2(X2)
PGEC2: J?#2.5(PGC) U?#12.35(PGEC2/RP4/CN4/RB4)
PGED2: J?#2.4(PGD) U?#12.34(PGED2/DACOUT/INT0/RP3/CN3/RB3)
PWM3H: U?#12.8(TMS/PWM3H/RP11/CN11/RB11) ; port PWM3_H
PWM3L: U?#12.9(TCK/PWM3L/RP12/CN12/RB12) ; port PWM3_L
RA0: U?#12.21(AN0/CMP1A/RA0)
RA1: U?#12.22(AN1/CMP1B/RA1)
RA2: U?#12.23(AN2/CMP1C/CMP2A/RA2)
RA4: U?#12.12(PWM1H/RA4)
RB0: U?#12.24(AN3/CMP1D/CMP2B/RP0/CN0/RB0)
RB5: U?#12.43(TDO/RP5/CN5/RB5)
RB6: U?#12.44(PGED1/TDI/SCL/RP6/CN6/RB6)
RB7: U?#12.1(PGEC1/SDA/RP7/CN7/RB7)
RB8: U?#12.41(PGED3/RP8/CN8/RB8)
RB9: U?#12.25(AN4/CMP2C/CMP3A/RP9/CN9/RB9)
RB10: U?#12.26(AN5/CMP2D/CMP3B/RP10/CN10/RB10)
RB13: U?#12.10(PWM2H/RP13/CN13/RB13)
RB14: U?#12.11(PWM2L/RP14/CN14/RB14)
RB15: U?#12.42(PGEC3/RP15/CN15/RB15)
RC0: U?#12.14(RP16/CN16/RC0)
RC1: U?#12.31(AN8/CMP4C/RP17/CN17/RC1)
RC2: U?#12.36(AN9/EXTREF/CMP4D/RP18/CN18/RC2)
RC3: U?#12.5(RP19/CN19/RC3)
RC4: U?#12.2(RP20/CN20/RC4)
RC5: U?#12.3(RP21/CN21/RC5)
RC6: U?#12.4(RP22/CN22/RC6)
RC7: U?#12.37(RP23/CN23/RC7)
RC8: U?#12.38(RP24/CN24/RC8)
RC9: U?#12.27(AN11/RP25/CN25/RC9)
RC10: U?#12.28(AN10/RP26/CN26/RC10)
RC11: U?#12.19(RP27/CN27/RC11)
RC12: U?#12.20(RP28/CN28/RC12)
RC13: U?#12.15(RP29/CN29/RC13)
Trigger: U?#12.13(PWM1L/RA3) ; port Trigger
V_CAP: C?#24.2 U?#12.7(VCAP/VDDCORE)
NetC?#27_2: C?#27.2 R?#55.1 R?#56.2 SW?.1 SW?.3

Not connected (* = marked no-connect by the designer): J?#2 6(NC)*

### Notes on the sheet
- TO-DO LIST
- REVISIONS
- dsPIC ölçüm ve kontrol sinyalleri için pinler belirlenecek
- ekstra özellikler için pinler ayrılacak örn on/off
- Labels drawn without touching a wire or pin: DC_I_SENSE

### Library data of the parts
C?#21-C?#23 C?#25-C?#27 = Capacitor Non-Polorized: as C?#1 on sheet Inverter and Drivers; Max Thickness: 1.9 mm; Technology: SMT
C?#24 = Capacitor Non-Polorized: Case-EIA: 1206; Tolerance: -20% to +80%; Rated Voltage: 25 V; Case-Metric: 3216; Value: 10uF; Max Thickness: 1.9 mm; Technology: SMT
J?#2 = 1x6 Header: 0.025" SQ Post Header, Through-hole, Right Angle, -55 to 125 degC, 2.54 mm Pitch, 6-Pin, Male, RoHS; Manufacturer: Samtec; Pitch: 2.54 mm; ComponentLink2URL: http://www.samtec.com/documents/webfiles/pdf/TSW_TH.PDF; ComponentLink3Description: Package Specification; PackageVersion: DM, 8/1988; ComponentLink3URL: http://www.samtec.com/documents/webfiles/cpdf/TSW-XXX-XX-XXX-X-XX-XXX-MKT.pdf; ComponentLink1Description: Manufacturer URL; RoHS: True; ComponentLink2Description: Datasheet; PackageDescription: .025[0.64] SQ. Post Terminal Strip Assembly; Temperature Range: -55 to 125 degC; Orientation: Right Angle; DatasheetVersion: F-214; PartNumber: TSW-106-08-L-S-RA; PackageReference: TSW-106-08-X-S-RA; ComponentLink1URL: http://www.samtec.com; Mounting Technology: Through-hole
R?#55 R?#56 = Resistor
SW? = 6x6 Button: WS-TASV SMD Tact Switch 6X6 mm; Manufacturer: Wuerth Elektronik; NoPins: 04; PartNumber: 430152043836; ComponentLink2URL: http://katalog.we-online.de/em/datasheet/4301x2.pdf; ComponentLink1URL: http://www.we-online.com; ComponentLink2Description: Datasheet; ComponentLink1Description: Manufacturer URL; PackageReference: 430152043836
U?#12 = DSPIC33FJ16GS504-I/PT: High-Performance 16-bit Digital Signal Controller, 16 KB Flash, 2 KB RAM , 44-Pin TQFP, Industrial Temperature; PackageVersion: revBB, Aug-2009; PackageDescription: 44-Lead Plastic Thin Quad Flatpack (PT) - 10x10x1mm Body, 2.00mm [TQFP]; Code_JEDEC: MS-026; PackageReference: TQFP-PT44; DatasheetVersion: revD, Mar-2009
X? = 8MHz Crystal: Low Profile Surface Mount Microprocessor Crystal, 4.096 MHz +/-30 ppm, 180 Ohm, -40 to 85 degC, 2-Pin 11.4 x 4.7 x 3.3 mm SMD, RoHS, Tape and Reel; Manufacturer: Abracon; PartNumber: ABLS2-4.096MHZ-D4Y-T; Operation Mode: Fundamental or 3rd Overtone; Shunt Capacitance: 7 pF Max.; ESR: 180 Ohm; Load Capacitance: 18 pF; Mounting Technology: Surface Mount; PackageDescription: 2-Pin SMD, Body 11.4 x 4.7 mm, Height 3.3 mm; ComponentLink1URL: http://www.abracon.com/; Freq. Stability: +/- 30 ppm; ComponentLink2Description: Datasheet; Operating Temp. Range: -40 to 85 degC; Packing: Tape and Reel; RoHS: TRUE; PackageReference: ABLS2-2; DatasheetVersion: Rev. 03.31.11; Freq. Tolerance: +/- 30 ppm; Frequency: 4.096 MHz; ComponentLink2URL: http://www.abracon.com/Resonators/ABLS2.pdf; ComponentLink1Description: Manufacturer URL

## Sheet Auxiliary Power.SchDoc
size A4
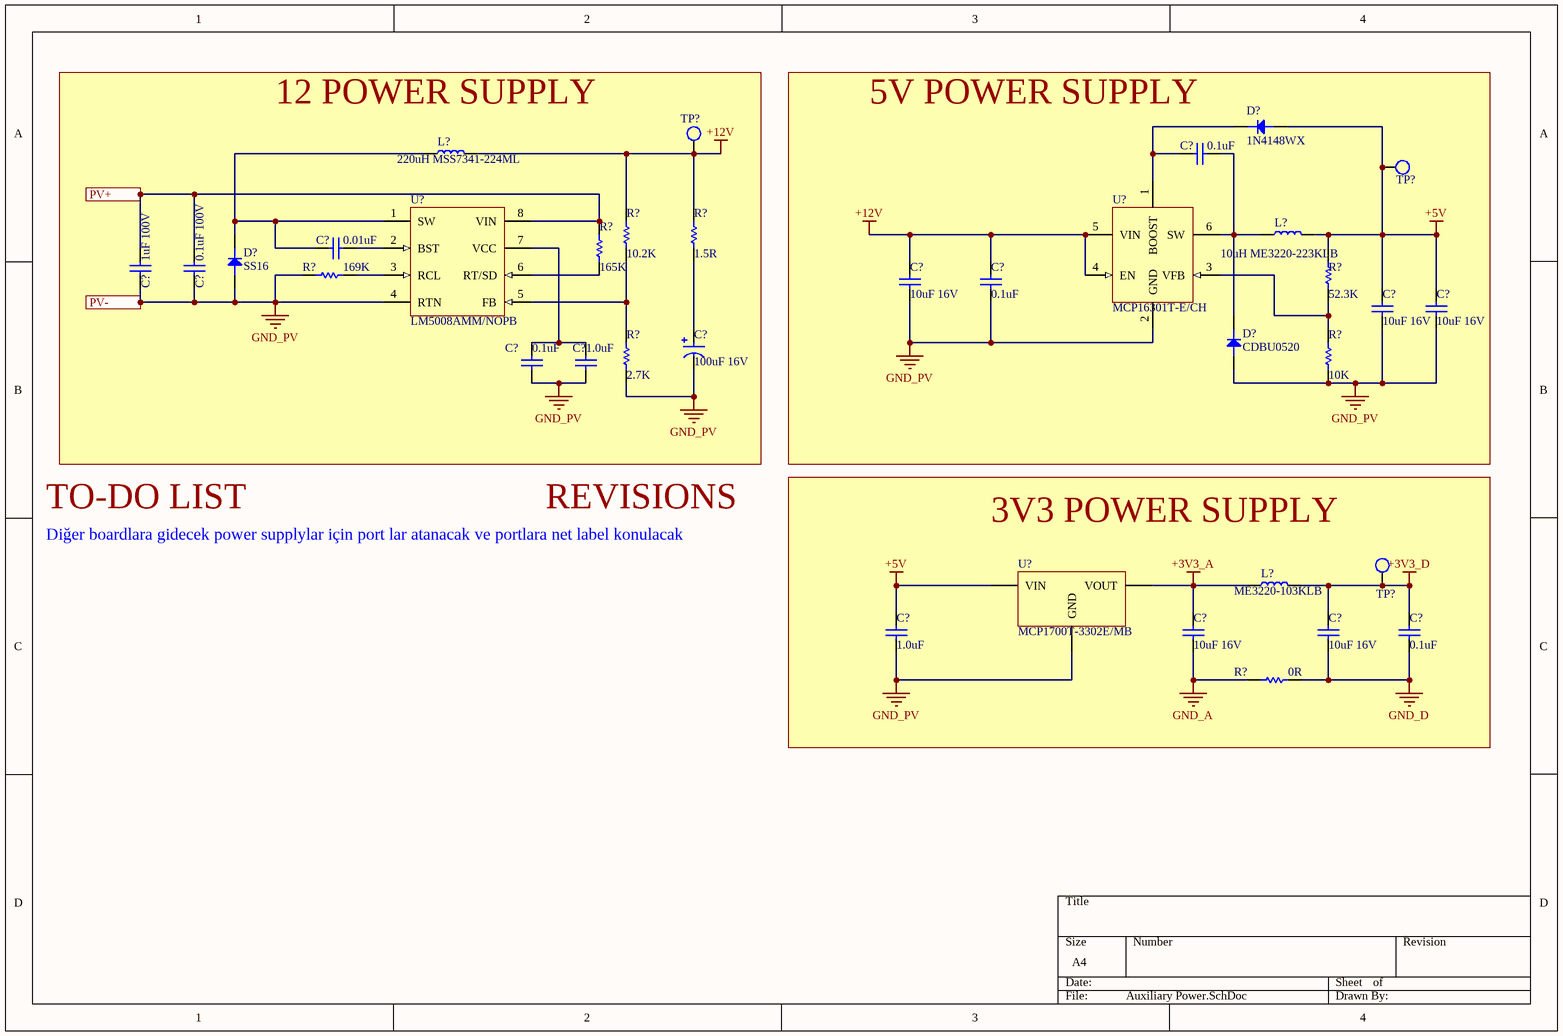
[diagram p6: Auxiliary Power.SchDoc]

### Parts
(Parts that share a designator on the sheet are numbered #1, #2 ... from top to bottom, then left to right.)
C?#28  0.1uF  [1206 CAPACITOR]
C?#29  0.01uF  [1206 CAPACITOR]
C?#30  1uF 100V  [1206 CAPACITOR]
C?#31  0.1uF 100V  [1206 CAPACITOR]
C?#32  10uF 16V  [1206 CAPACITOR]
C?#33  0.1uF  [1206 CAPACITOR]
C?#34  10uF 16V  [1206 CAPACITOR]
C?#35  10uF 16V  [1206 CAPACITOR]
C?#36  100uF 16V  [1206 CAPACITOR]
C?#37  0.1uF  [1206 CAPACITOR]
C?#38  1.0uF  [1206 CAPACITOR]
C?#39  1.0uF  [1206 CAPACITOR]
C?#40  10uF 16V  [1206 CAPACITOR]
C?#41  10uF 16V  [1206 CAPACITOR]
C?#42  0.1uF  [1206 CAPACITOR]
D?#11  1N4148WX  [SOD-323]
D?#12  SS16  [DO-214AC-SMA]
D?#13  CDBU0520  [SOT-523F]
L?#3  220uH MSS7341-224ML  [Inductor MSS7341-224ML]
L?#4  10uH ME3220-223KLB  [Inductor MEE3220-223KLB]
L?#5  ME3220-103KLB  [Inductor MEE3220-223KLB]
R?#57  10.2K  [1206 Resistor Footprint]
R?#58  1.5R  [1206 Resistor Footprint]
R?#59  165K  [1206 Resistor Footprint]
R?#60  169K  [1206 Resistor Footprint]
R?#61  52.3K  [1206 Resistor Footprint]
R?#62  2.7K  [1206 Resistor Footprint]
R?#63  10K  [1206 Resistor Footprint]
R?#64  0R  [1206 Resistor Footprint]
TP?#8  Test Point  [Test Point]  (value not drawn)
TP?#9  Test Point  [Test Point]  (value not drawn)
TP?#10  Test Point  [Test Point]  (value not drawn)
U?#13  LM5008AMM/NOPB  [TSOP 8-LEADS]
U?#14  MCP16301T-E/CH  [SOT-23-6]
U?#15  MCP1700T-3302E/MB  [SOT23-3]

### Blocks framed on the sheet
12 POWER SUPPLY: C?#29-C?#31 C?#36-C?#38 D?#12 L?#3 R?#57-R?#60 R?#62 TP?#8 U?#13
5V POWER SUPPLY: C?#28 C?#32-C?#35 D?#11 D?#13 L?#4 R?#61 R?#63 TP?#9 U?#14
3V3 POWER SUPPLY: C?#39-C?#42 L?#5 R?#64 TP?#10 U?#15

### Ports
PV+, PV-

### Nets
+3V3_A: C?#40.2 L?#5.1 U?#15.3(VOUT)
+3V3_D: C?#41.2 C?#42.2 L?#5.2 TP?#10.1
+5V: C?#34.2 C?#35.2 C?#39.2 D?#11.A L?#4.2 R?#61.2 TP?#9.1 U?#15.2(VIN)
+12V: C?#32.2 C?#33.2 L?#3.2 R?#57.2 R?#58.2 TP?#8.1 U?#14.4(EN) U?#14.5(VIN)
GND_A: C?#40.1 R?#64.2
GND_D: C?#41.1 C?#42.1 R?#64.1
GND_PV: C?#30.1 C?#31.1 C?#32.1 C?#33.1 C?#34.1 C?#35.1 C?#36.1 C?#37.1 C?#38.1 C?#39.1 D?#12.A D?#13.A R?#60.1 R?#62.1 R?#63.1 U?#13.4(RTN) U?#14.2(GND) U?#15.1(GND) ; port PV-  [project net TH3_1]
PV+: C?#30.2 C?#31.2 R?#59.2 U?#13.8(VIN) ; port PV+
NetC?#28_1: C?#28.1 D?#11.K U?#14.1(BOOST)
NetC?#28_2: C?#28.2 D?#13.K L?#4.1 U?#14.6(SW)
NetC?#29_1: C?#29.1 D?#12.K L?#3.1 U?#13.1(SW)
NetC?#29_2: C?#29.2 U?#13.2(BST)
NetC?#36_2: C?#36.2 R?#58.1
NetC?#37_2: C?#37.2 C?#38.2 U?#13.7(VCC)
NetR?#57_1: R?#57.1 R?#62.2 U?#13.5(FB)
NetR?#59_1: R?#59.1 U?#13.6(RT/SD)
NetR?#60_2: R?#60.2 U?#13.3(RCL)
NetR?#61_1: R?#61.1 R?#63.2 U?#14.3(VFB)

### Notes on the sheet
- TO-DO LIST
- REVISIONS
- Diğer boardlara gidecek power supplylar için port lar atanacak ve portlara net label konulacak

### Library data of the parts
C?#28-C?#31 C?#33 C?#37-C?#39 C?#42 = Capacitor Non-Polorized: as C?#1 on sheet Inverter and Drivers; Max Thickness: 1.9 mm; Technology: SMT
C?#32 C?#34 C?#35 C?#40 C?#41 = Capacitor Non-Polorized: as C?#24 on sheet Digital Circuit; Value: 10uF; Max Thickness: 1.9 mm; Technology: SMT
C?#36 = Capacitor Polorized: Value: 10uF; Case-EIA: 1206; Tolerance: -20% to +80%; Rated Voltage: 25 V; Case-Metric: 3216; Max Thickness: 1.9 mm; Technology: SMT
D?#11-D?#13 = Diode
L?#3-L?#5 = Inductor
R?#57-R?#64 = Resistor
U?#13 = LM5008AMM: 100V, 350 mA Constant On-Time Buck Switching Regulator, 8-pin MSOP, Pb-Free; Manufacturer: Texas Instruments; CompType: Switcher; PackageTopMarking: ZXTT*SAYA; PowerWise: N; Code_JEDEC: MO-187-AA; ComponentLink1Description: Datasheet URL; RoHS: Y; PinCount: 8; PackageReference: DGK0008A; PackageDescription: MINI SOIC, .118 x .118 x .034in, 8 Lead, .0256in Pitch; ComponentLink1URL: http://www.ti.com/general/docs/lit/getliterature.tsp?genericPartNumber=LM5008A&fileType=pdf
U?#14 = MCP16301T-E/CH: High-Voltage Input Integrated Switch Step-Down Regulator, 600 mA, Input Voltage 4.0 to 30 V, Output Voltage 2.0 to 15 V, -40 to 125 degC, 6-pin SOT-23 (CH6), Tape and Reel; Manufacturer: Microchip; ComponentLink3Description: Package Specification; PackageDescription: 6-Lead Plastic Small Outline Transistor, 2.9 x 1.55 mm Body, 0.95 mm Pitch; PackageReference: SOT-23-CH6; ComponentLink4Description: Product URL; ComponentLink1URL: http://www.microchip.com; ComponentLink4URL: http://www.microchip.com/MCP16301; ComponentLink2Description: Datasheet; Mounting Technology: Surface Mount; DatasheetVersion: Rev. B; ComponentLink1Description: Manufacturer URL; PartNumber: MCP16301T-E/CH; ComponentLink2URL: http://ww1.microchip.com/downloads/en/DeviceDoc/25004B.pdf; ComponentLink3URL: http://www.microchip.com/stellent/groups/techpub_sg/documents/packagingspec/en012702.pdf; PackageVersion: C04-028B
U?#15 = MCP1700T-3302E/MB: MICROCHIP - MCP1700T-3302E/MB - V REG, LDO, 0.25A, SMD, SOT-89-8; Supplier 1: Avnet; Manufacturer: Microchip; Manufacturer Part Number: MCP1700T-3302E/MB; RoHS: Yes; Category: Voltage Regulators - Linear; Stock 1: 7000; Pricing 1: 1000=0.30000, 2000=0.29520, 4000=0.28800, 6000=0.28320, 8000=0.27840 (USD); ComponentLink1URL: https://datasheet.ciiva.com/2040/21826b-2040133.pdf?src-supplier=Digi-Key; ComponentLink1Description: https://datasheet.ciiva.com/2040/21826b-2040133.pdf?src-supplier=Digi-Key; ComponentLink2URL: https://datasheet.ciiva.com/8239/21826b-8239141.pdf?src-supplier=Avnet; ComponentLink2Description: https://datasheet.ciiva.com/8239/21826b-8239141.pdf?src-supplier=Avnet; ComponentLink3URL: https://datasheet.ciiva.com/2040/21826b-2040134.pdf?src-supplier=Digi-Key; ComponentLink3Description: https://datasheet.ciiva.com/2040/21826b-2040134.pdf?src-supplier=Digi-Key; ComponentLink4URL: https://datasheet.ciiva.com/46425/21826b-46425574.pdf?src-supplier=Element14; ComponentLink4Description: https://datasheet.ciiva.com/46425/21826b-46425574.pdf?src-supplier=Element14; ComponentLink5URL: https://datasheet.ciiva.com/2040/21826b-2040135.pdf?src-supplier=Digi-Key; ComponentLink5Description: https://datasheet.ciiva.com/2040/21826b-2040135.pdf?src-supplier=Digi-Key; ComponentLink6URL: https://datasheet.ciiva.com/14150/mcp1700-eng-tds-14150121.pdf?src-supplier=Distrelec; ComponentLink6Description: https://datasheet.ciiva.com/14150/mcp1700-eng-tds-14150121.pdf?src-supplier=Distrelec; ComponentLink7URL: https://datasheet.ciiva.com/22710/77612-22710987.pdf?src-supplier=Element14; ComponentLink7Description: https://datasheet.ciiva.com/22710/77612-22710987.pdf?src-supplier=Element14; ComponentLink8URL: https://datasheet.ciiva.com/16372/filehandler-aspxddocname-en011779-16372940.pdf?src-supplier=Future+Electronics; ComponentLink8Description: https://datasheet.ciiva.com/16372/filehandler-aspxddocname-en011779-16372940.pdf?src-supplier=Future+Electronics; Supplier Part Number 1: MCP1700T-3302E/MB

## Nets that join several sheets
+3V3_A: Input Sensors (D?#6.2 D?#8.2), Output Sensors (D?#9.2 D?#10.2), Digital Circuit (U?#12.17), Auxiliary Power (C?#40.2 L?#5.1 U?#15.3)
+3V3_D: Digital Circuit (7 pins), Auxiliary Power (C?#41.2 C?#42.2 L?#5.2 TP?#10.1)
+5V: Input Sensors (C?#7.2 U?#5.8), Output Sensors (5 pins), EMI Filter (C?#20.2 U?#11.8), Auxiliary Power (8 pins)
+12V: Inverter and Drivers (C?#1.1 Q?.8), Auxiliary Power (8 pins)
GND_A: Inverter and Drivers (R?#7.1 R?#13.1), Input Sensors (13 pins), Output Sensors (10 pins), EMI Filter (C?#19.1 C?#20.1 U?#11.5), Digital Circuit (U?#12.16), Auxiliary Power (C?#40.1 R?#64.2)
GND_D: Inverter and Drivers (Q?.3), Digital Circuit (13 pins), Auxiliary Power (C?#41.1 C?#42.1 R?#64.1)
TH3_1: Inverter and Drivers (5 pins), Input Sensors (BP?#2.1 BP?#2.2 C?#2.1 R?#18.1), Auxiliary Power (18 pins)
AC_L: Output Sensors (R?#37.1), EMI Filter (C?#18.1 F?#2.1 L?#2.2 MOV?.2)
AC_N: Output Sensors (R?#31.1), EMI Filter (C?#13.2 F?#1.1 L?#1.2 MOV?.1)
I_OUT: Output Sensors (R?#47.1), EMI Filter (U?#11.7)
PV+: Inverter and Drivers (D?#1.A WS?.D), Input Sensors (6 pins), Auxiliary Power (C?#30.2 C?#31.2 R?#59.2 U?#13.8)
PWM3H: Inverter and Drivers (R?#9.1), Digital Circuit (U?#12.8)
PWM3L: Inverter and Drivers (R?#3.1), Digital Circuit (U?#12.9)
TH1_1: Inverter and Drivers (TH1.K TH3.A U?#1.6), EMI Filter (?.2 C?#12.2 C?#14.2 C?#15.2)
TH2_1: Inverter and Drivers (TH2.K TH4.A U?#3.6), EMI Filter (C?#14.1 U?#11.3 U?#11.4)
Trigger: Inverter and Drivers (R?#1.1), Digital Circuit (U?#12.13)